# EAGLE schematic v1.1 (EAGLE 9.1.3)
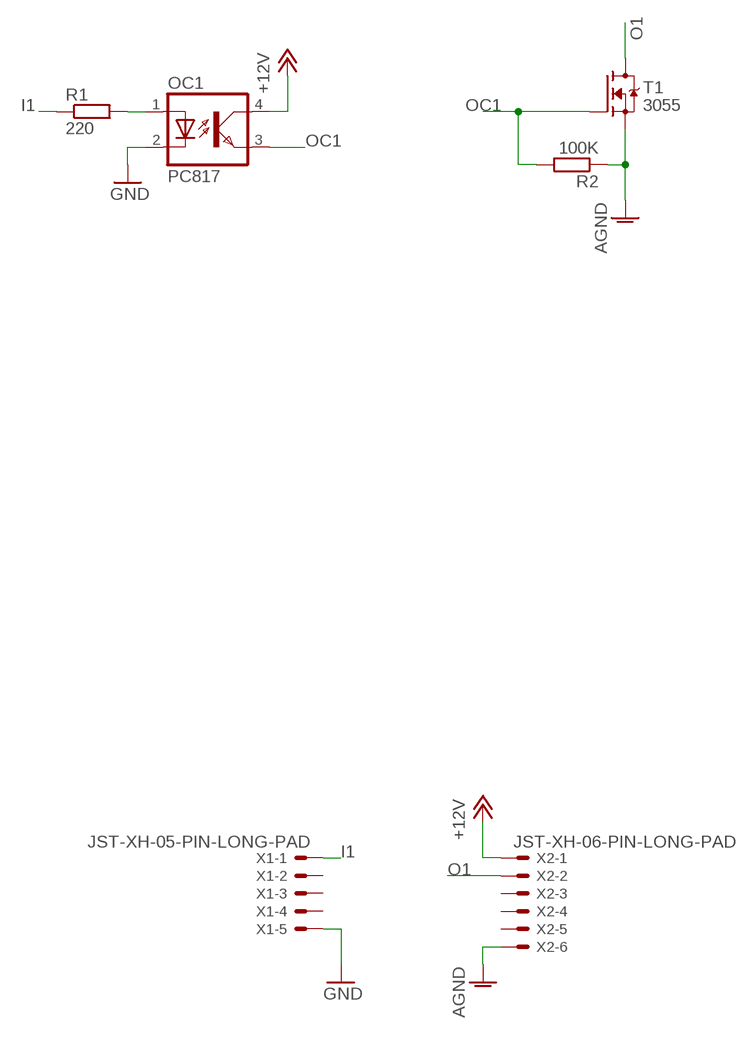
[diagram p0: schematic, sheet 1]

## Parts
OC1  PC817  [DIL04]
R1  220  R-EU_R0603  [R0603]
R2  100K  R-EU_R0603  [R0603]
T1  3055  MOSFET-N-SOT223  [SOT223]
X1  JST-XH-05-PIN-LONG-PAD  [JST-XH-05-PACKAGE-LONG-PAD]
X2  JST-XH-06-PIN-LONG-PAD  [JST-XH-06-PACKAGE-LONG-PAD]

## Nets
+12V: OC1.4(COL) X2.1
AGND: R2.1 T1.3(S) X2.6
GND: OC1.2(C) X1.5
I1: R1.1 X1.1
N$1: OC1.1(A) R1.2
O1: T1.2(D) T1.4(D) X2.2
OC1: OC1.3(EMIT) R2.2 T1.1(G)
Unconnected: X1.2 X1.3 X1.4 X2.3 X2.4 X2.5

## Library data of the parts
OC1 = optocoupler-3-jcn:PC817: SHARP OPTO COUPLER
R1 R2 = resistor:R-EU_: RESISTOR, European symbol
T1 = we-transistor:MOSFET-N: N-Channel MOSFET SOT23 N-Chn MOSFET TSM3404, IRLML2502 (Vgs>=+/-20V, Vds<=20V, Id>=3A + Rds<=0.05Ohm @ Vgs=4.5V) BSS138 (Vgs>=+/-20V, Vds<=40V, Id>=0.2A + Rds<=3Ohm @ Vgs=4.5V) SOT223 Low Side Switch with Protection (Infineon) BSP76 (Vin=0...10V, Vds<=42V, Id=1.4A + Rds=0.2Ohm @ Vin=5V) BSP77 (Vin=0...10V, Vds<=42V, Id=2.2A + Rds=0.1Ohm @ Vin=5V) D²Pak Low Side Switch with Protection (Infineon) BTS117TC (Vin=0...10V, Vds<=60V, Id=3.5A + Rds=0.12Ohm @ Vin=5V) BTS133TC (Vin=0...10V, Vds<=60V, Id=7A + Rds=0.06Ohm @ Vin=5V) BTS141TC (Vin=0...10V, Vds<=60V, Id=12A + Rds=0.03Ohm @ Vin=5V) BTS3018TC (Vin=0...10V, Vds<=60V, Id=6A + Rds=0.02Ohm @ Vin=5V)
X1 = Rembrandt:JST-XH-05-PIN: JST XH Connector 2 Pin Wire to board connector. Pitch: 2,54 mm, (0.100") Number of pins: 5 Created by Rembrandt Electronics www.rembrandtelectronics.com
X2 = Rembrandt:JST-XH-06-PIN: JST XH Connector 2 Pin Wire to board connector. Pitch: 2,54 mm, (0.100") Number of pins: 6 Created by Rembrandt Electronics www.rembrandtelectronics.com